# Altium schematic sheet memory.SchDoc
size A4
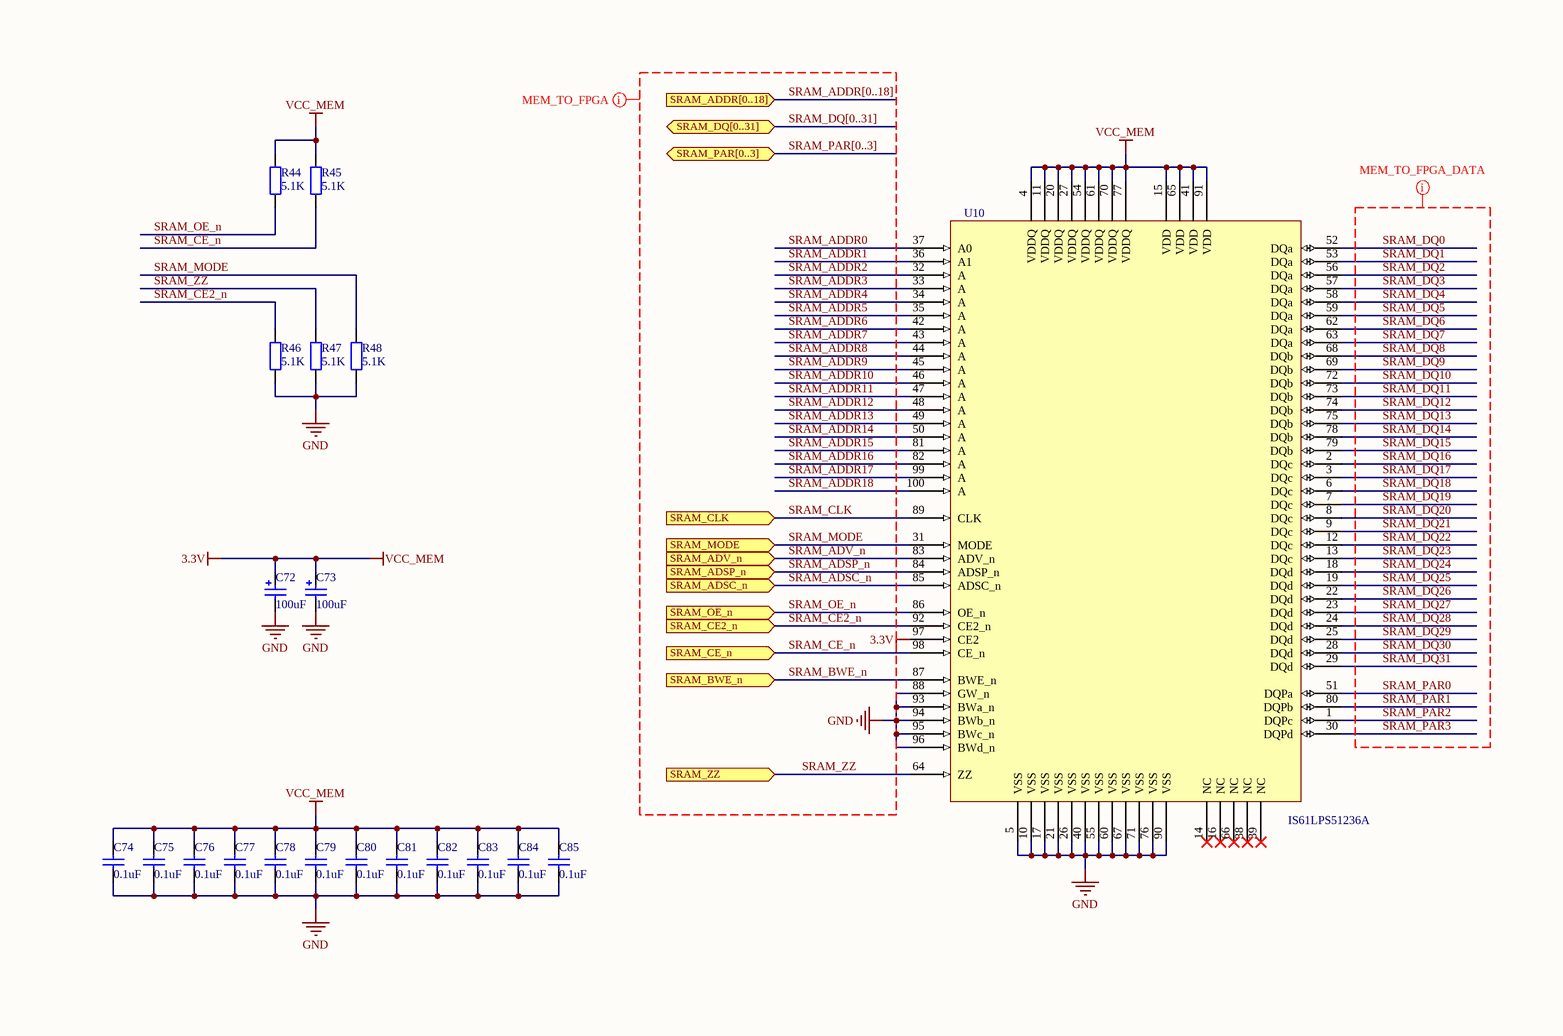
[diagram p0: memory.SchDoc]

## Parts
C72  value 100uF  [C1206_POLARIZED]  (hidden comment: Cap Pol2)
C73  value 100uF  [C1206_POLARIZED]  (hidden comment: Cap Pol2)
C74  value 0.1uF  [0402]  (hidden comment: Cap)
C75  value 0.1uF  [0402]  (hidden comment: Cap)
C76  value 0.1uF  [0402]  (hidden comment: Cap)
C77  value 0.1uF  [0402]  (hidden comment: Cap)
C78  value 0.1uF  [0402]  (hidden comment: Cap)
C79  value 0.1uF  [0402]  (hidden comment: Cap)
C80  value 0.1uF  [0402]  (hidden comment: Cap)
C81  value 0.1uF  [0402]  (hidden comment: Cap)
C82  value 0.1uF  [0402]  (hidden comment: Cap)
C83  value 0.1uF  [0402]  (hidden comment: Cap)
C84  value 0.1uF  [0402]  (hidden comment: Cap)
C85  value 0.1uF  [0402]  (hidden comment: Cap)
R44  value 5.1K  [J1-0603]  (hidden comment: Res2)
R45  value 5.1K  [J1-0603]  (hidden comment: Res2)
R46  value 5.1K  [J1-0603]  (hidden comment: Res2)
R47  value 5.1K  [J1-0603]  (hidden comment: Res2)
R48  value 5.1K  [J1-0603]  (hidden comment: Res2)
U10  IS61LPS51236A  [TQFP100]

## Ports
SRAM_ADDR[0..18] (in), SRAM_ADSC_n (in), SRAM_ADSP_n (in), SRAM_ADV_n (in), SRAM_BWE_n (in), SRAM_CE2_n (in), SRAM_CE_n (in), SRAM_CLK (in), SRAM_DQ[0..31] (bidir), SRAM_MODE (in), SRAM_OE_n (in), SRAM_PAR[0..3] (bidir), SRAM_ZZ (in)

## Nets
3.3V: C72.1 C73.1 C74.1 C75.1 C76.1 C77.1 C78.1 C79.1 C80.1 C81.1 C82.1 C83.1 C84.1 C85.1 R44.1 R45.1 U10.4(VDDQ) U10.11(VDDQ) U10.15(VDD) U10.20(VDDQ) U10.27(VDDQ) U10.41(VDD) U10.54(VDDQ) U10.61(VDDQ) U10.65(VDD) U10.70(VDDQ) U10.77(VDDQ) U10.91(VDD) U10.97(CE2)  [also labelled VCC_MEM]
GND: C72.2 C73.2 C74.2 C75.2 C76.2 C77.2 C78.2 C79.2 C80.2 C81.2 C82.2 C83.2 C84.2 C85.2 R46.2 R47.2 R48.2 U10.5(VSS) U10.10(VSS) U10.17(VSS) U10.21(VSS) U10.26(VSS) U10.40(VSS) U10.55(VSS) U10.60(VSS) U10.67(VSS) U10.71(VSS) U10.76(VSS) U10.88(GW_n) U10.90(VSS) U10.93(BWa_n) U10.94(BWb_n) U10.95(BWc_n) U10.96(BWd_n)
SRAM_ADDR0: U10.37(A0)
SRAM_ADDR1: U10.36(A1)
SRAM_ADDR2: U10.32(A)
SRAM_ADDR3: U10.33(A)
SRAM_ADDR4: U10.34(A)
SRAM_ADDR5: U10.35(A)
SRAM_ADDR6: U10.42(A)
SRAM_ADDR7: U10.43(A)
SRAM_ADDR8: U10.44(A)
SRAM_ADDR9: U10.45(A)
SRAM_ADDR10: U10.46(A)
SRAM_ADDR11: U10.47(A)
SRAM_ADDR12: U10.48(A)
SRAM_ADDR13: U10.49(A)
SRAM_ADDR14: U10.50(A)
SRAM_ADDR15: U10.81(A)
SRAM_ADDR16: U10.82(A)
SRAM_ADDR17: U10.99(A)
SRAM_ADDR18: U10.100(A)
SRAM_ADSC_n: U10.85(ADSC_n) ; port SRAM_ADSC_n
SRAM_ADSP_n: U10.84(ADSP_n) ; port SRAM_ADSP_n
SRAM_ADV_n: U10.83(ADV_n) ; port SRAM_ADV_n
SRAM_BWE_n: U10.87(BWE_n) ; port SRAM_BWE_n
SRAM_CE2_n: R46.1 U10.92(CE2_n) ; port SRAM_CE2_n
SRAM_CE_n: R45.2 U10.98(CE_n) ; port SRAM_CE_n
SRAM_CLK: U10.89(CLK) ; port SRAM_CLK
SRAM_DQ0: U10.52(DQa)
SRAM_DQ1: U10.53(DQa)
SRAM_DQ2: U10.56(DQa)
SRAM_DQ3: U10.57(DQa)
SRAM_DQ4: U10.58(DQa)
SRAM_DQ5: U10.59(DQa)
SRAM_DQ6: U10.62(DQa)
SRAM_DQ7: U10.63(DQa)
SRAM_DQ8: U10.68(DQb)
SRAM_DQ9: U10.69(DQb)
SRAM_DQ10: U10.72(DQb)
SRAM_DQ11: U10.73(DQb)
SRAM_DQ12: U10.74(DQb)
SRAM_DQ13: U10.75(DQb)
SRAM_DQ14: U10.78(DQb)
SRAM_DQ15: U10.79(DQb)
SRAM_DQ16: U10.2(DQc)
SRAM_DQ17: U10.3(DQc)
SRAM_DQ18: U10.6(DQc)
SRAM_DQ19: U10.7(DQc)
SRAM_DQ20: U10.8(DQc)
SRAM_DQ21: U10.9(DQc)
SRAM_DQ22: U10.12(DQc)
SRAM_DQ23: U10.13(DQc)
SRAM_DQ24: U10.18(DQd)
SRAM_DQ25: U10.19(DQd)
SRAM_DQ26: U10.22(DQd)
SRAM_DQ27: U10.23(DQd)
SRAM_DQ28: U10.24(DQd)
SRAM_DQ29: U10.25(DQd)
SRAM_DQ30: U10.28(DQd)
SRAM_DQ31: U10.29(DQd)
SRAM_MODE: R48.1 U10.31(MODE) ; port SRAM_MODE
SRAM_OE_n: R44.2 U10.86(OE_n) ; port SRAM_OE_n
SRAM_PAR0: U10.51(DQPa)
SRAM_PAR1: U10.80(DQPb)
SRAM_PAR2: U10.1(DQPc)
SRAM_PAR3: U10.30(DQPd)
SRAM_ZZ: R47.1 U10.64(ZZ) ; port SRAM_ZZ

Not connected (* = marked no-connect by the designer): U10 14(NC)* 16(NC)* 38(NC)* 39(NC)* 66(NC)*

## Buses and harness runs
bus SRAM_ADDR[0..18] = port SRAM_ADDR[0..18]
bus SRAM_DQ[0..31] = port SRAM_DQ[0..31]
bus SRAM_PAR[0..3] = port SRAM_PAR[0..3]

## Layout directives
net class MEM_TO_FPGA: GND, SRAM_ADDR0, SRAM_ADDR1, SRAM_ADDR2, SRAM_ADDR3, SRAM_ADDR4, SRAM_ADDR5, SRAM_ADDR6, SRAM_ADDR7, SRAM_ADDR8, SRAM_ADDR9, SRAM_ADDR10, SRAM_ADDR11, SRAM_ADDR12, SRAM_ADDR13, SRAM_ADDR14, SRAM_ADDR15, SRAM_ADDR16, SRAM_ADDR17, SRAM_ADDR18, SRAM_ADDR[0..18], SRAM_ADSC_n, SRAM_ADSP_n, SRAM_ADV_n, SRAM_BWE_n, SRAM_CE2_n, SRAM_CE_n, SRAM_CLK, SRAM_DQ[0..31], SRAM_MODE, SRAM_OE_n, SRAM_PAR[0..3], SRAM_ZZ
net class MEM_TO_FPGA_DATA; net class MEM_TO_FPGA: SRAM_DQ0, SRAM_DQ1, SRAM_DQ2, SRAM_DQ3, SRAM_DQ4, SRAM_DQ5, SRAM_DQ6, SRAM_DQ7, SRAM_DQ8, SRAM_DQ9, SRAM_DQ10, SRAM_DQ11, SRAM_DQ12, SRAM_DQ13, SRAM_DQ14, SRAM_DQ15, SRAM_DQ16, SRAM_DQ17, SRAM_DQ18, SRAM_DQ19, SRAM_DQ20, SRAM_DQ21, SRAM_DQ22, SRAM_DQ23, SRAM_DQ24, SRAM_DQ25, SRAM_DQ26, SRAM_DQ27, SRAM_DQ28, SRAM_DQ29, SRAM_DQ30, SRAM_DQ31, SRAM_PAR0, SRAM_PAR1, SRAM_PAR2, SRAM_PAR3

## Library data of the parts
C72 C73 = Cap Pol2: Polarized Capacitor (Axial); Published: 8-Jun-2000; LatestRevisionDate: 17-Jul-2002; LatestRevisionNote: Re-released for DXP Platform.; PackageReference: POLAR0.8; Publisher: Altium Limited; PackageDescription: Polarized Capacitor; 2 Leads
C74-C85 = Cap: Capacitor; Published: 8-Jun-2000; LatestRevisionDate: 17-Jul-2002; LatestRevisionNote: Re-released for DXP Platform.; PackageReference: RAD-0.3; Publisher: Altium Limited; PackageDescription: Radial Cap, Thru-Hole; 2 Leads; 0.3 in Pin Spacing
R44-R48 = Res2: Resistor; Published: 8-Jun-2000; LatestRevisionDate: 17-Jul-2002; LatestRevisionNote: Re-released for DXP Platform.; PackageReference: AXIAL-0.4; Publisher: Altium Limited; PackageDescription: Axial Device, Thru-Hole; 2 Leads; 0.4 in Pin Spacing
U10 = IS61LPS51236A: 18Mb 36-bit SRAM